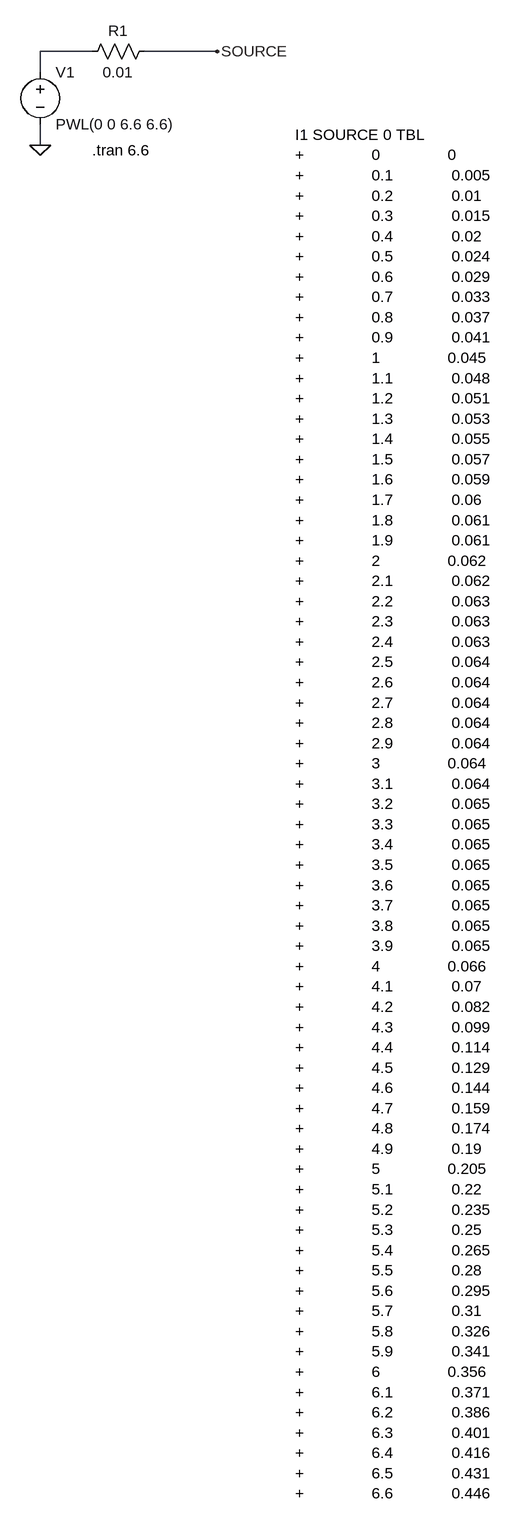
[diagram p0: schematic Fig_2-55_Current_TBL.asc]
Fig_2-55_Current_TBL.asc, the LTspice schematic file:
Version 4
SHEET 1 1152 2164
WIRE 208 144 128 144
WIRE 400 144 288 144
WIRE 128 176 128 144
WIRE 128 288 128 256
FLAG 400 144 SOURCE
FLAG 128 288 0
SYMBOL res 192 160 R270
WINDOW 0 32 56 VTop 2
WINDOW 3 0 56 VBottom 2
SYMATTR InstName R1
SYMATTR Value 0.01
SYMBOL voltage 128 160 R0
WINDOW 123 0 0 Left 2
WINDOW 39 0 0 Left 2
SYMATTR InstName V1
SYMATTR Value PWL(0 0 6.6 6.6)
TEXT 208 296 Left 2 !.tran 6.6
TEXT 520 272 Left 2 !I1 SOURCE 0 TBL\n+               0               0\n+               0.1             0.005\n+               0.2             0.01\n+               0.3             0.015\n+               0.4             0.02\n+               0.5             0.024\n+               0.6             0.029\n+               0.7             0.033\n+               0.8             0.037\n+               0.9             0.041\n+               1               0.045\n+               1.1             0.048\n+               1.2             0.051\n+               1.3             0.053\n+               1.4             0.055\n+               1.5             0.057\n+               1.6             0.059\n+               1.7             0.06\n+               1.8             0.061\n+               1.9             0.061\n+               2               0.062\n+               2.1             0.062\n+               2.2             0.063\n+               2.3             0.063\n+               2.4             0.063\n+               2.5             0.064\n+               2.6             0.064\n+               2.7             0.064\n+               2.8             0.064\n+               2.9             0.064\n+               3               0.064\n+               3.1             0.064\n+               3.2             0.065\n+               3.3             0.065\n+               3.4             0.065\n+               3.5             0.065\n+               3.6             0.065\n+               3.7             0.065\n+               3.8             0.065\n+               3.9             0.065\n+               4               0.066\n+               4.1             0.07\n+               4.2             0.082\n+               4.3             0.099\n+               4.4             0.114\n+               4.5             0.129\n+               4.6             0.144\n+               4.7             0.159\n+               4.8             0.174\n+               4.9             0.19\n+               5               0.205\n+               5.1             0.22\n+               5.2             0.235\n+               5.3             0.25\n+               5.4             0.265\n+               5.5             0.28\n+               5.6             0.295\n+               5.7             0.31\n+               5.8             0.326\n+               5.9             0.341\n+               6               0.356\n+               6.1             0.371\n+               6.2             0.386\n+               6.3             0.401\n+               6.4             0.416\n+               6.5             0.431\n+               6.6             0.446

The netlist it stands for:
* Fig_2-55_Current_TBL.asc
R1 N001 SOURCE 0.01
V1 N001 0 PWL(0 0 6.6 6.6)
.tran 6.6
I1 SOURCE 0 TBL
+               0               0
+               0.1             0.005
+               0.2             0.01
+               0.3             0.015
+               0.4             0.02
+               0.5             0.024
+               0.6             0.029
+               0.7             0.033
+               0.8             0.037
+               0.9             0.041
+               1               0.045
+               1.1             0.048
+               1.2             0.051
+               1.3             0.053
+               1.4             0.055
+               1.5             0.057
+               1.6             0.059
+               1.7             0.06
+               1.8             0.061
+               1.9             0.061
+               2               0.062
+               2.1             0.062
+               2.2             0.063
+               2.3             0.063
+               2.4             0.063
+               2.5             0.064
+               2.6             0.064
+               2.7             0.064
+               2.8             0.064
+               2.9             0.064
+               3               0.064
+               3.1             0.064
+               3.2             0.065
+               3.3             0.065
+               3.4             0.065
+               3.5             0.065
+               3.6             0.065
+               3.7             0.065
+               3.8             0.065
+               3.9             0.065
+               4               0.066
+               4.1             0.07
+               4.2             0.082
+               4.3             0.099
+               4.4             0.114
+               4.5             0.129
+               4.6             0.144
+               4.7             0.159
+               4.8             0.174
+               4.9             0.19
+               5               0.205
+               5.1             0.22
+               5.2             0.235
+               5.3             0.25
+               5.4             0.265
+               5.5             0.28
+               5.6             0.295
+               5.7             0.31
+               5.8             0.326
+               5.9             0.341
+               6               0.356
+               6.1             0.371
+               6.2             0.386
+               6.3             0.401
+               6.4             0.416
+               6.5             0.431
+               6.6             0.446
.backanno
.end